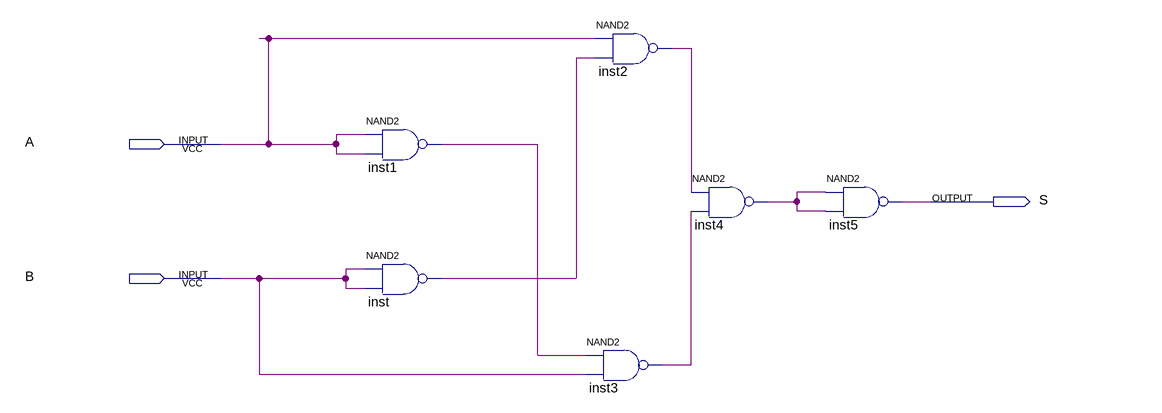
[diagram p0: schematic sheet]
// Quartus schematic lab4d.bdf as structural Verilog: 6 symbols, 3 pins
module lab4d (
  input  A,
  input  B,
  output S
);

  wire inst1_out, inst2_out, inst3_out, inst4_out, inst_out;

  nand inst1 (inst1_out, A, A);
  nand inst (inst_out, B, B);
  nand inst2 (inst2_out, A, inst_out);
  nand inst3 (inst3_out, inst1_out, B);
  nand inst4 (inst4_out, inst2_out, inst3_out);
  nand inst5 (S, inst4_out, inst4_out);
endmodule
